# EAGLE design projeson1 (EAGLE 6.3)
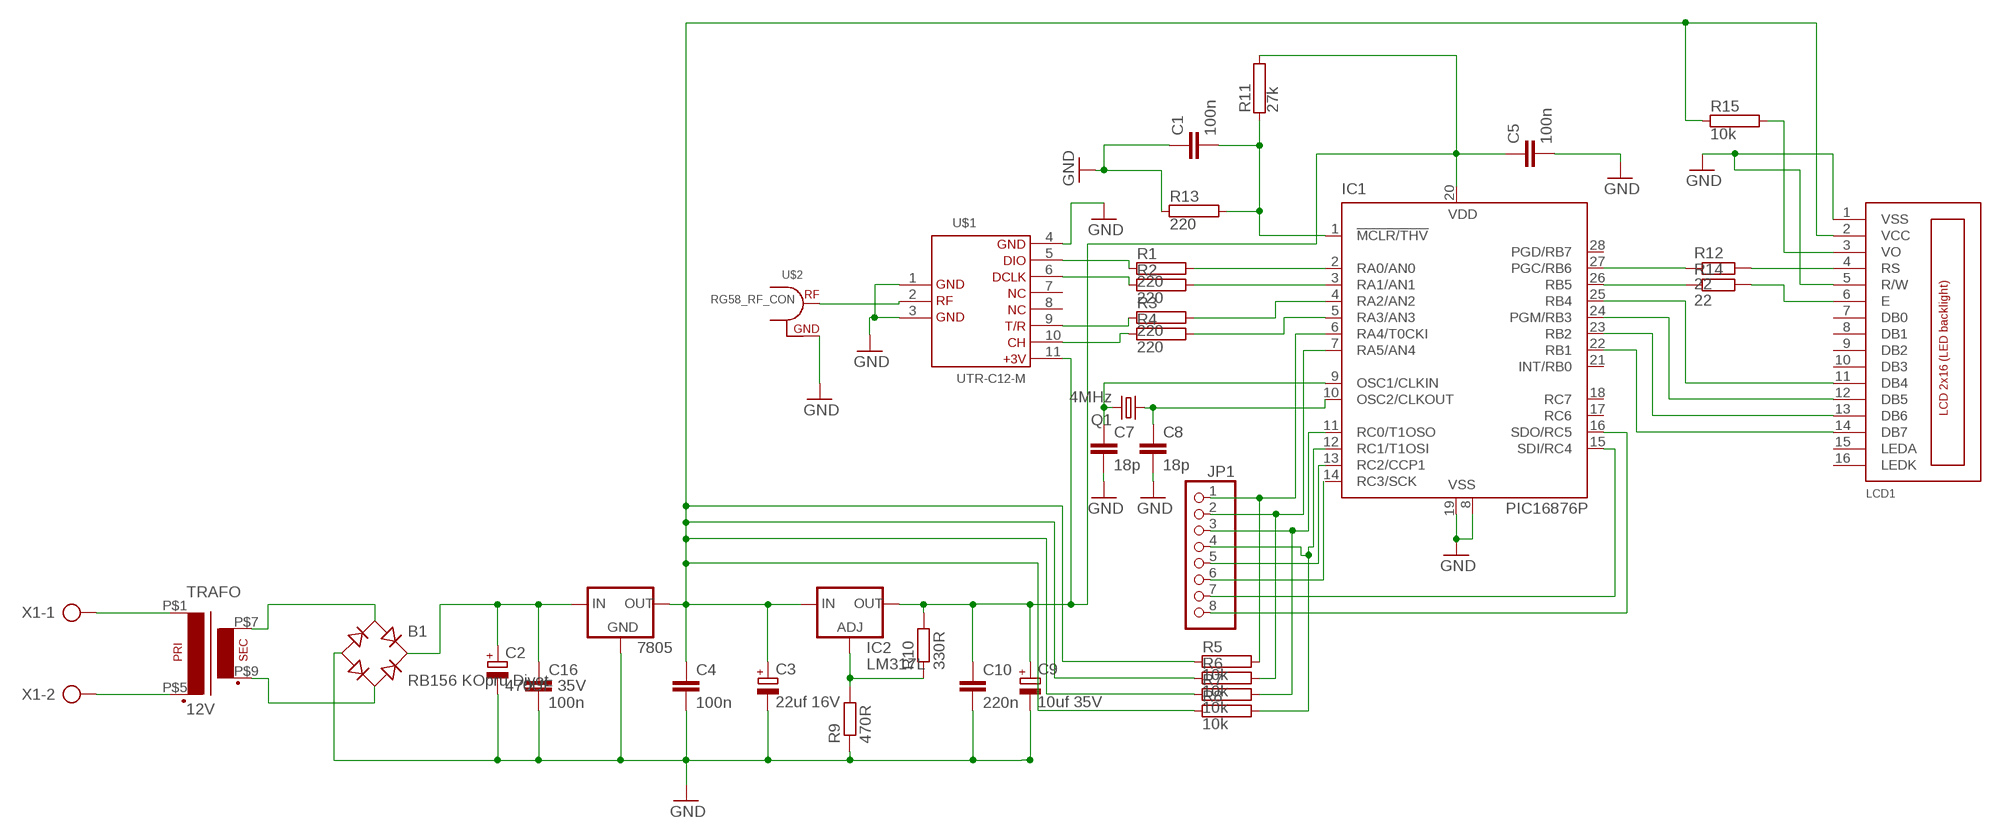
[diagram p0: schematic, sheet 1]

## Parts
7805  78XXS  [78XXS]
B1  RB156 KOpru Diyot  RB1A  [RB1A]
C1  100n  C-EU025-030X050  [C025-030X050]
C2  470UF 35V  CPOL-EUE3.5-10  [E3,5-10]
C3  22uf 16V  CPOL-EUE2.5-7  [E2,5-7]
C4  100n  C-EU050-025X075  [C050-025X075]
C5  100n  C-EU025-025X050  [C025-025X050]
C7  18p  C-EU025-025X050  [C025-025X050]
C8  18p  C-EU025-025X050  [C025-025X050]
C9  10uf 35V  CPOL-EUE2.5-7  [E2,5-7]
C10  220n  C-EU050-025X075  [C050-025X075]
C16  100n  C-EU050-025X075  [C050-025X075]
IC1  PIC16876P  [DIL28-3]
IC2  LM317L  [317L]
JP1  PINHD-1X8  [1X08]
LCD1  LCD_2X16_SIL  [HY-1602F]
Q1  4MHz  CRYTALHC49S  [HC49/S]
R1  220  RAC04  [AC04]
R2  220  RAC04  [AC04]
R3  220  RAC04  [AC04]
R4  220  RAC04  [AC04]
R5  10k  RAC04  [AC04]
R6  10k  RAC04  [AC04]
R7  10k  RAC04  [AC04]
R8  10k  RAC04  [AC04]
R9  470R  R-EU_0207/10  [0207/10]
R10  330R  R-EU_0207/10  [0207/10]
R11  27k  RAC04  [AC04]
R12  22  R-EU_0204/5  [0204/5]
R13  220  RAC04  [AC04]
R14  22  R-EU_0204/5  [0204/5]
R15  10k  RAC04  [AC04]
TRAFO  12V  TRAFO  [E3031TRF]
U$1  UTR-C12-M  [UTR-C12-M]
U$2  RG58_RF_CON  [RG58_RF_CON]
X1  AK300/3  [AK300/3]

## Nets
GND: 7805.GND B1.- C1.1 C2.- C3.- C4.2 C5.2 C7.2 C8.2 C9.- C10.2 C16.2 IC1.8(VSS) IC1.19(VSS) LCD1.1(VSS) LCD1.5(R/W) R9.1 R13.1 U$1.1 U$1.3 U$1.4 U$2.GND
N$1: R1.1 U$1.5
N$2: R3.1 U$1.9
N$3: IC1.4(RA2/AN2) R3.2
N$4: R4.1 U$1.10
N$5: IC1.2(RA0/AN0) R1.2
N$6: IC1.3(RA1/AN1) R2.2
N$7: LCD1.6(E) R14.2
N$8: IC1.5(RA3/AN3) R4.2
N$9: LCD1.3(VO) R15.2
N$10: IC1.6(RA4/T0CKI) JP1.1 R5.2
N$11: IC1.7(RA5/AN4) JP1.2 R6.2
N$12: IC1.11(RC0/T1OSO) JP1.3 R7.2
N$13: IC1.12(RC1/T1OSI) JP1.4 R8.2
N$14: IC1.13(RC2/CCP1) JP1.5
N$15: JP1.6
N$16: IC1.15(SDI/RC4) JP1.7
N$17: IC1.16(SDO/RC5) JP1.8
N$18: LCD1.4(RS) R12.2
N$19: IC1.26(RB5) R14.1
N$20: IC1.25(RB4) LCD1.11(DB4)
N$21: IC1.24(PGM/RB3) LCD1.12(DB5)
N$22: IC1.23(RB2) LCD1.13(DB6)
N$23: IC1.22(RB1) LCD1.14(DB7)
N$24: TRAFO.P$5 X1.2
N$25: B1.AC1 TRAFO.P$7
N$26: B1.AC2 TRAFO.P$9
N$27: 7805.IN B1.+ C2.+ C16.1
N$28: TRAFO.P$1 X1.1
N$29: IC2.1(ADJ) R9.2 R10.1
N$30: IC1.27(PGC/RB6) R12.1
N$31: U$1.2 U$2.RF
N$32: C1.2 IC1.1(!MCLR/THV) R11.1 R13.2
N$34: C7.1 IC1.9(OSC1/CLKIN) Q1.2
N$35: C8.1 IC1.10(OSC2/CLKOUT) Q1.1
N$37: R2.1 U$1.6
N$38: 7805.OUT C3.+ C4.1 IC2.3(IN) LCD1.2(VCC) R5.1 R6.1 R7.1 R8.1 R15.1
N$41: C5.1 C9.+ C10.1 IC1.20(VDD) IC2.2(OUT) R10.2 R11.2 U$1.11
Unconnected: IC1.14(RC3/SCK) IC1.17(RC6) IC1.18(RC7) IC1.21(INT/RB0) IC1.28(PGD/RB7) LCD1.7(DB0) LCD1.8(DB1) LCD1.9(DB2) LCD1.10(DB3) LCD1.15(LEDA) LCD1.16(LEDK) U$1.7 U$1.8 X1.3

## Library data of the parts
7805 = v-reg:78XXS: VOLTAGE REGULATOR
B1 = rectifier:RB1A: RECTIFIER 1 A
C1 C4 C5 C7 C8 C10 C16 = rcl:C-EU: CAPACITOR, European symbol
C2 C3 C9 = rcl:CPOL-EU: POLARIZED CAPACITOR, European symbol
IC1 = microchip:PIC16*876: MICROCONTROLLER flash type; OC_FARNELL: unknown; OC_NEWARK: unknown
IC2 = v-reg:LM317L: VOLTAGE REGULATOR
JP1 = pinhead:PINHD-1X8: PIN HEADER
LCD1 = lcd_2x16_led_backlight:LCD_2X16_SIL
Q1 = crystal:CRYTAL: CRYSTAL
R1-R8 R11 R13 R15 = resistor-power:R: Power Resitor; OC_FARNELL: unknown; OC_NEWARK: unknown
R9 R10 R12 R14 = rcl:R-EU_: RESISTOR, European symbol
TRAFO = UDEA3:TRAFO
U$1 = UDEA_HAKKI:UTR-C12-M
U$2 = UDEA_HAKKI:RG58_RF_CON
X1 = con-ptr500:AK300/3: CONNECTOR; OC_FARNELL: unknown; OC_NEWARK: unknown

## Board
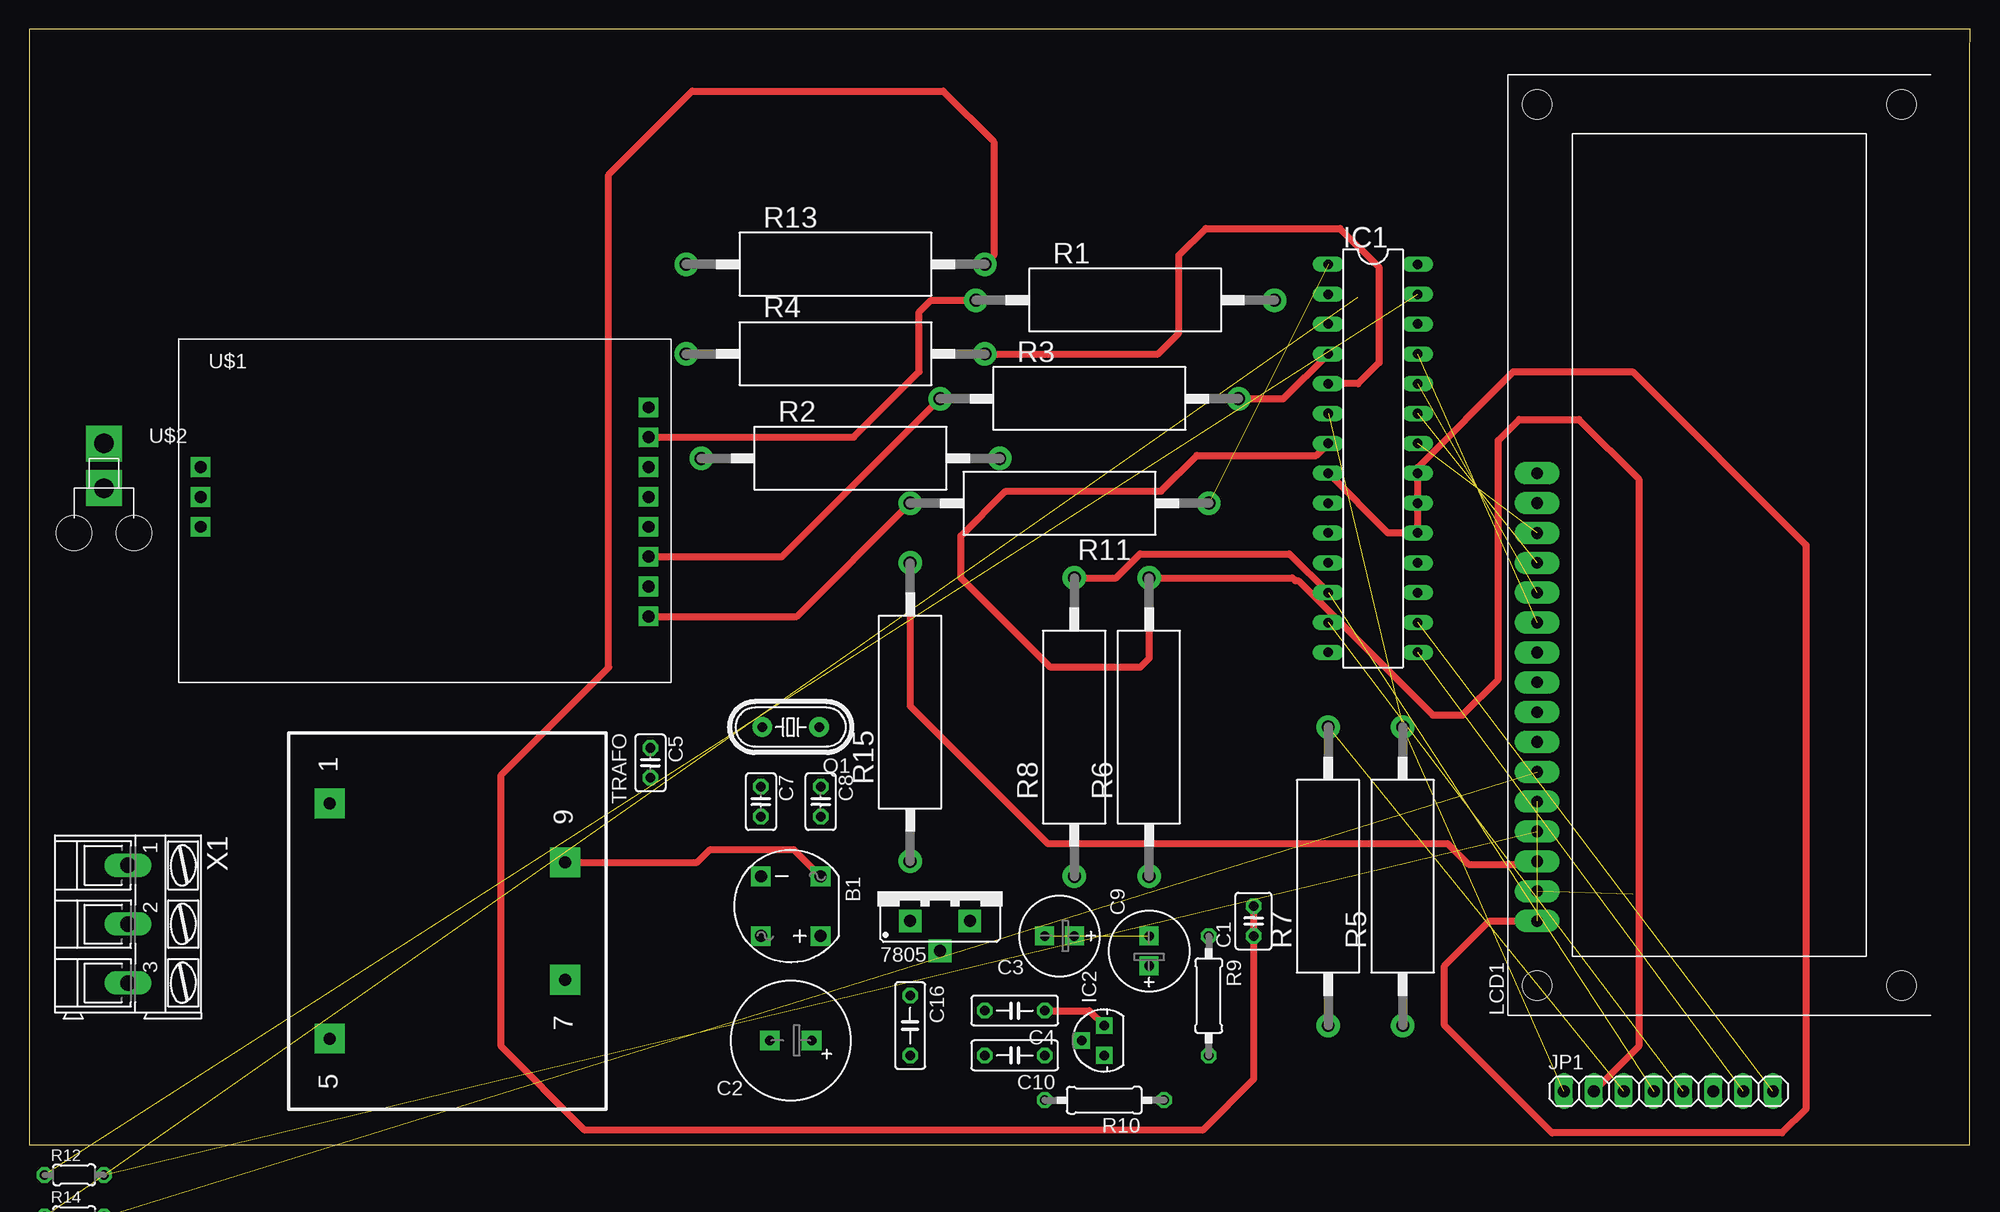
[diagram p1: board, top side]
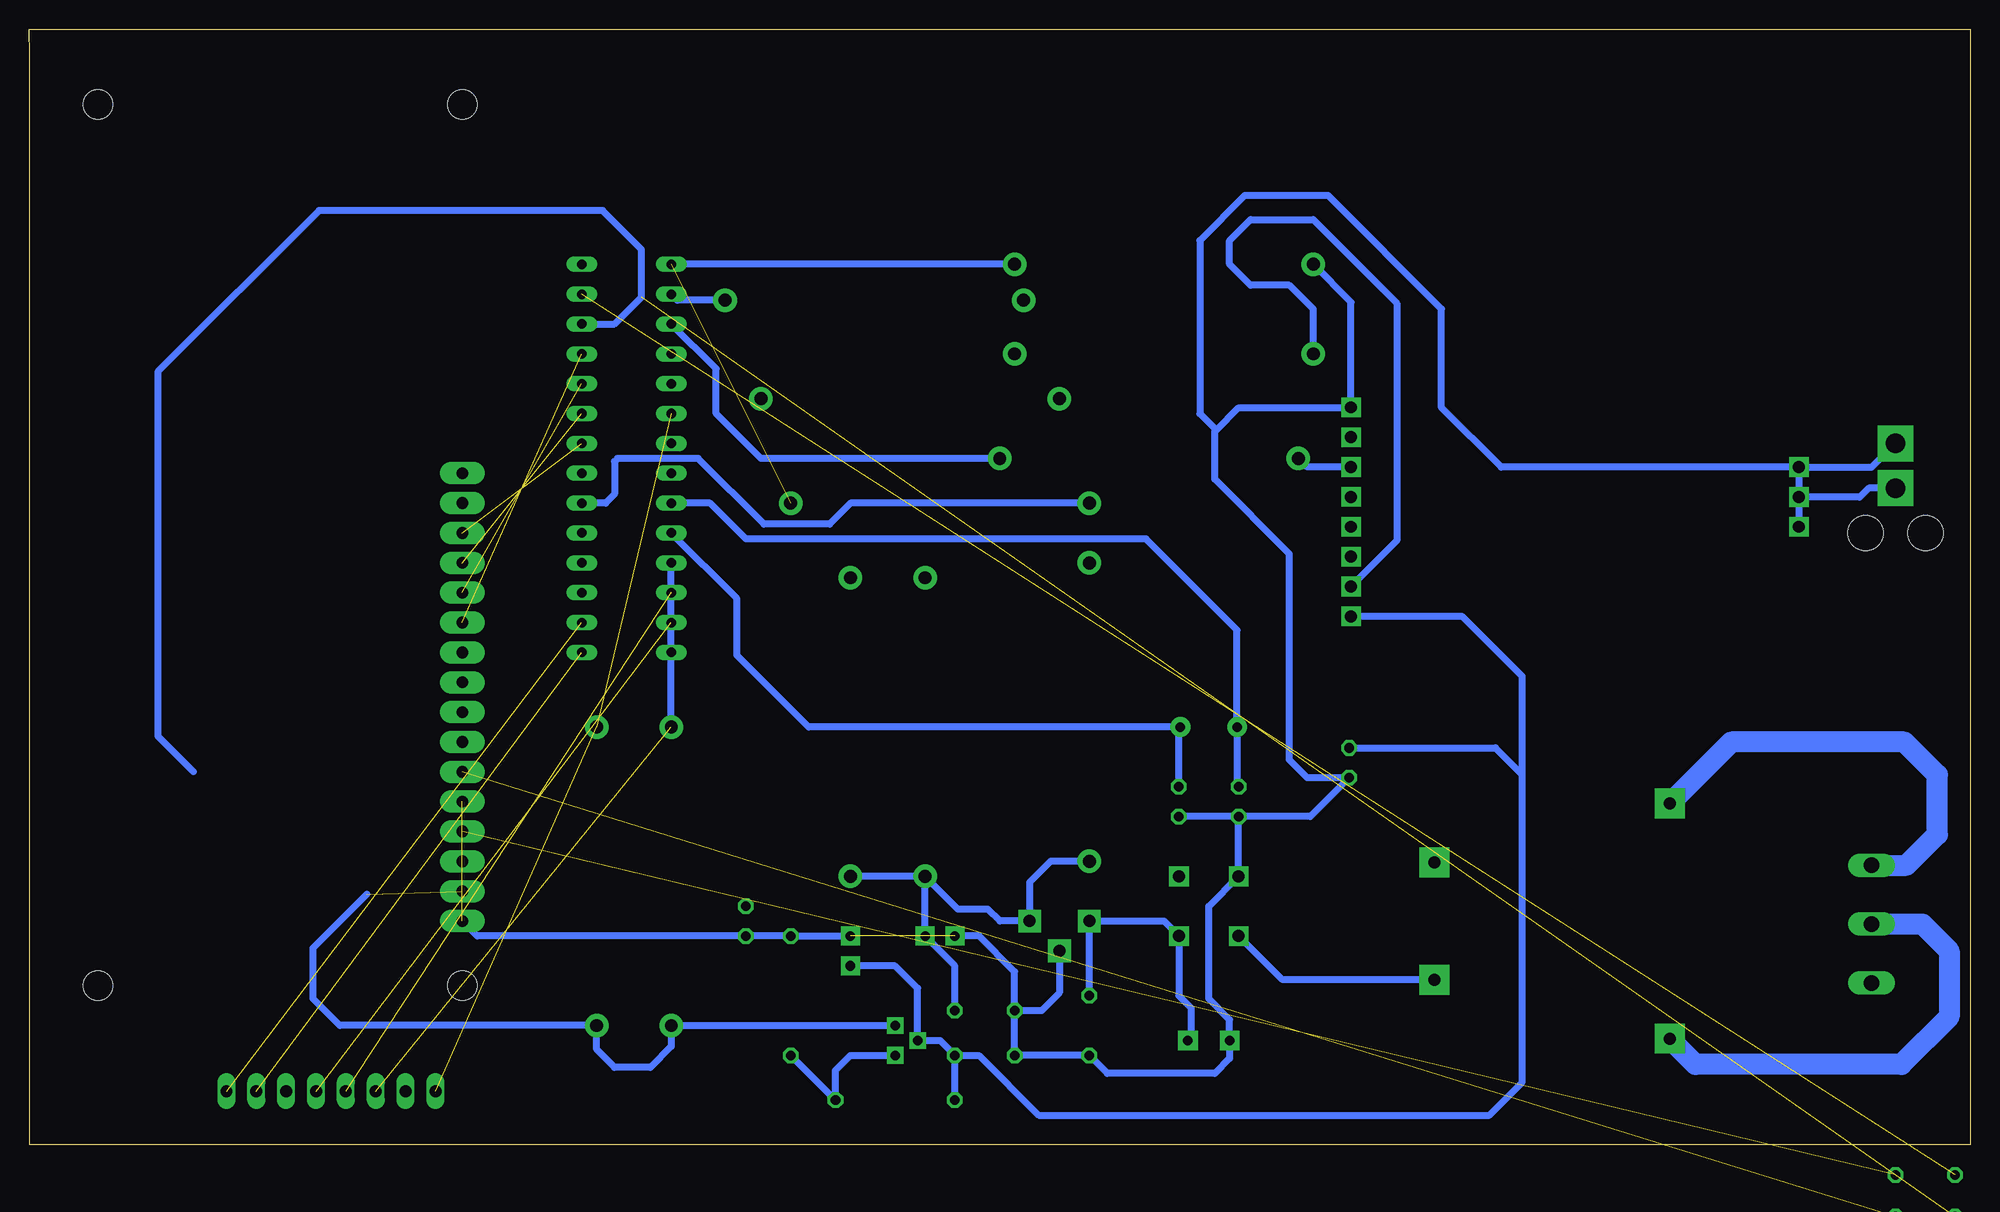
[diagram p2: board, bottom side, seen from below]

Size 165.1 x 94.92 mm. Coordinates in mm from the lower left corner, seen from the top.
Outline: 0,0 165.08,0 165.08,93.65 165.1,93.98 165.1,94.92 0,94.92 0,0
Copper layers (1*16): Top 0.035mm / dielectric 1.5mm / Bottom 0.035mm
Design rules "default": minimum track width 10mil, minimum drill 24mil, track to track 8mil, track to pad 8mil, pad to pad 8mil, via to via 8mil, smd to smd 8mil, copper to edge 40mil, drill to drill 8mil, minimum pad ring 10mil, minimum via ring 8mil, stop-mask expansion 4mil, vias tented up to drill 0mil, thermal gap 10mil

### Footprints (pad centres in the part's own frame; a part is rotated, then mirrored left to right if it is on the bottom)
78XXS = drill 1.016 pad 1.93 square: GND 0,-5.08; IN -2.54,-2.54; OUT 2.54,-2.54
RB1A = drill 1.016 pad 1.676 square: + -2.54,2.54; - 2.54,-2.54; AC1 2.54,2.54; AC2 -2.54,-2.54
C025-030X050 = drill 0.813 octagon: 1 -1.27,0; 2 1.27,0
E3,5-10 = drill 0.813 pad 1.676 square: + -1.778,0; - 1.778,0
E2,5-7 = drill 0.813 pad 1.6 square: + -1.27,0; - 1.27,0
C050-025X075 = drill 0.813 octagon: 1 -2.54,0; 2 2.54,0
C025-025X050 = drill 0.813 octagon: 1 -1.27,0; 2 1.27,0
DIL28-3 = drill 0.813 long: 1 -16.51,-3.81; 2 -13.97,-3.81; 3 -11.43,-3.81; 4 -8.89,-3.81; 5 -6.35,-3.81; 6 -3.81,-3.81; 7 -1.27,-3.81; 8 1.27,-3.81; 9 3.81,-3.81; 10 6.35,-3.81; 11 8.89,-3.81; 12 11.43,-3.81; 13 13.97,-3.81; 14 16.51,-3.81; 15 16.51,3.81; 16 13.97,3.81; 17 11.43,3.81; 18 8.89,3.81; 19 6.35,3.81; 20 3.81,3.81; 21 1.27,3.81; 22 -1.27,3.81; 23 -3.81,3.81; 24 -6.35,3.81; 25 -8.89,3.81; 26 -11.43,3.81; 27 -13.97,3.81; 28 -16.51,3.81
317L = drill 0.813 pad 1.422 square: 1 -1.27,0; 2 0,1.905; 3 1.27,0
1X08 = drill 1.016 long: 1 -8.89,0; 2 -6.35,0; 3 -3.81,0; 4 -1.27,0; 5 1.27,0; 6 3.81,0; 7 6.35,0; 8 8.89,0
HY-1602F = drill 1 pad 1.93 long: 1 2.54,0; 2 5.08,0; 3 7.62,0; 4 10.16,0; 5 12.7,0; 6 15.24,0; 7 17.78,0; 8 20.32,0; 9 22.86,0; 10 25.4,0; 11 27.94,0; 12 30.48,0; 13 33.02,0; 14 35.56,0; 15 38.1,0; 16 40.64,0 | hole 2.5: -2.96,0; 72.04,0; -2.96,-31; 72.04,-31
HC49/S = drill 0.813 pad 1.676: 1 -2.413,0; 2 2.413,0
AC04 = drill 1.1 pad 2: 1 -12.7,0; 2 12.7,0
0207/10 = drill 0.813 octagon: 1 -5.08,0; 2 5.08,0
0204/5 = drill 0.813 octagon: 1 -2.54,0; 2 2.54,0
E3031TRF = drill 1.016 pad 2.54 square: P$1 -10,-10; P$5 10,-10; P$7 5,10; P$9 -5,10
UTR-C12-M = drill 1.016 pad 1.676 square: 1 -17.188,4.333; 2 -17.188,1.796; 3 -17.188,-0.739; 4 20.912,9.421; 5 20.912,6.878; 6 20.912,4.341; 7 20.912,1.801; 8 20.912,-0.742; 9 20.912,-3.282; 10 20.912,-5.817; 11 20.916,-8.358
RG58_RF_CON = drill 1.676 pad 3.048 square: GND 0,7.62; RF 0,3.81 | hole 2.997: -2.54,0; 2.54,0
AK300/3 = drill 1.321 long: 1 -5.004,0; 2 0,0; 3 5.004,0

### Placement (x,y rotation side)
7805  77.47,21.59 0 top
B1  64.77,20.32 180 top
C1  104.14,19.05 90 top
C2  64.77,8.89 180 top
C3  87.63,17.78 180 top
C4  83.82,11.43 180 top
C5  52.83,32.51 270 top
C7  62.23,29.21 270 top
C8  67.31,29.21 270 top
C9  95.25,16.51 90 top
C10  83.82,7.62 180 top
C16  74.93,10.16 270 top
IC1  114.3,58.42 270 top
IC2  91.44,8.89 90 top
JP1  139.45,4.57 0 top
LCD1  128.27,16.51 90 top
Q1  64.77,35.56 180 top
R1  93.22,71.88 0 top
R2  69.85,58.42 0 top
R3  90.17,63.5 0 top
R4  68.58,67.31 0 top
R5  116.84,22.86 90 top
R6  95.25,35.56 90 top
R7  110.49,22.86 90 top
R8  88.9,35.56 90 top
R9  100.33,12.7 270 top
R10  91.44,3.81 180 top
R11  87.63,54.61 180 top
R12  3.81,-2.54 0 top
R13  68.58,74.93 0 top
R14  3.81,-6.1 0 top  (outside the outline)
R15  74.93,36.83 90 top
TRAFO  35.56,19.05 270 top
U$1  31.75,53.34 0 top
U$2  6.35,52.07 0 top
X1  8.38,18.8 270 top

### Tracks (layer width: path | path; a pad name or v marks a point on that pad's centre or on a via)
GND  (2 unrouted)
  Top 0.61: IC1.8 115.57,52.07 IC1.19 118.11,57.66 126.24,65.79 136.4,65.79 151.13,51.05 151.13,3.05 149.1,1.02 129.54,1.02 120.4,10.16 120.4,15.24 124.21,19.05 LCD1.1
  Bottom 0.61: C4.2 C10.2 C16.2 73.41,6.1 64.26,6.1 62.99,7.37 C2.- 62.99,10.67 64.77,12.45 64.77,20.32 B1.- C7.2 | C4.2 81.28,14.73 84.33,17.78 C3.- | 7805.GND 77.47,12.95 78.99,11.43 C4.2 | LCD1.1 127,17.78 C1.1 R9.1 C9.- | C7.2 C8.2 | C7.2 56.13,27.94 C5.2 56.39,31.24 57.91,32.77 57.91,50.29 64.26,56.64 64.26,60.71 64.14,60.83 | 64.14,60.83 62.23,62.74 52.69,62.74 U$1.4 52.66,71.71 R13.1 | U$1.1 39.89,57.67 44.96,62.74 44.96,71.12 54.61,80.77 61.72,80.77 65.53,76.96 65.53,62.23 64.14,60.83 | U$1.1 8.37,57.67 U$2.GND | U$1.1 U$1.3
N$1
  Top 0.61: U$1.5 70.12,60.22 75.69,65.79 75.69,70.87 76.71,71.88 R1.1
N$2
  Top 0.61: U$1.9 64.03,50.06 R3.1
N$3
  Top 0.61: R3.2 106.68,63.5 IC1.4
N$4
  Bottom 0.61: R4.1 55.88,71.12 57.91,73.15 61.21,73.15 62.99,74.93 62.99,76.96 61.21,78.74 55.88,78.74 48.77,71.63 48.77,51.42 U$1.10
N$5
  Bottom 0.61: R1.2 109.98,71.88 IC1.2
N$6
  Bottom 0.61: R2.2 102.87,58.42 106.68,62.23 106.68,66.04 IC1.3
N$7  (1 unrouted)
N$8
  Top 0.61: R4.2 96.01,67.31 97.79,69.09 97.79,75.69 100.08,77.98 111.51,77.98 114.81,74.68 114.81,66.55 113.03,64.77 IC1.5
N$9
  Top 0.61: R15.2 74.93,37.34 86.61,25.65 120.65,25.65 122.43,23.88 128.02,23.88 LCD1.3
N$10  (2 unrouted)
N$11
  Top 0.61: IC1.7 109.47,58.67 99.31,58.67 96.27,55.63 83.06,55.63 79.25,51.82 79.25,48.26 86.87,40.64 94.49,40.64 95.25,41.4 R6.2 107.44,48.26 107.7,48.01 107.95,48.01 119.38,36.58 121.92,36.58 124.97,39.62 124.97,59.94 126.75,61.72 131.83,61.72 136.91,56.64 136.91,8.38 JP1.2
N$12  (1 unrouted)
  Bottom 0.61: R7.2 IC1.11
N$13  (1 unrouted)
  Top 0.61: R8.2 92.46,48.26 94.49,50.29 107.19,50.29 IC1.12
N$14  (1 unrouted)
N$16  (1 unrouted)
N$17  (1 unrouted)
N$18  (1 unrouted)
N$19  (1 unrouted)
  Bottom 0.61: IC1.26 115.32,69.85 113.03,72.14 113.03,76.2 116.33,79.5 140.46,79.5 154.18,65.79 154.18,34.8 151.13,31.75
N$20  (1 unrouted)
N$21  (1 unrouted)
N$22  (1 unrouted)
N$23  (1 unrouted)
N$24
  Bottom 1.778: X1.2 4.06,18.8 1.78,16.51 1.78,10.92 5.84,6.86 23.37,6.86 TRAFO.P$5
N$25
  Bottom 0.61: TRAFO.P$7 58.5,14.05 B1.AC1
N$26
  Top 0.61: TRAFO.P$9 56.82,24.05 57.91,25.15 65.02,25.15 B1.AC2
N$27
  Bottom 0.61: C16.1 7805.IN 68.58,19.05 B1.+ 67.31,12.7 66.29,11.68 66.29,9.14 C2.+
N$28
  Bottom 1.778: X1.1 5.41,23.8 2.79,26.42 2.79,31.5 5.59,34.29 20.32,34.29 TRAFO.P$1
N$29
  Bottom 0.61: R9.2 R10.1 96.52,6.35 95.25,7.62 IC2.1
N$30  (1 unrouted)
N$31
  Bottom 0.61: U$2.RF 8.64,55.88 9.4,55.12 14.54,55.12 U$1.2
N$32  (1 unrouted)
  Top 0.61: C1.2 104.14,5.59 99.82,1.27 47.24,1.27 40.13,8.38 40.13,31.5 49.28,40.64 49.28,82.55 56.39,89.66 77.72,89.66 82.04,85.34 82.04,75.69 R13.2
  Bottom 0.61: R13.2 IC1.1
N$34
  Bottom 0.61: C7.1 62.36,30.61 Q1.2 62.36,43.81 70.1,51.56 104.14,51.56 107.19,54.61 IC1.9
N$35
  Bottom 0.61: C8.1 67.31,35.43 Q1.1 98.81,35.56 104.9,41.66 104.9,46.48 IC1.10
N$37
  Bottom 0.61: U$1.6 56.41,57.68 R2.1
N$38  (1 unrouted)
  Top 0.61: C4.1 90.17,11.43 IC2.3
  Bottom 0.61: IC2.3 R7.1 110.49,8.38 112.27,6.6 115.32,6.6 116.84,8.13 R5.1 138.68,10.16 140.97,12.45 140.97,16.76 136.4,21.34 | C4.1 86.36,15.24 C3.+ R8.1 | R15.1 78.23,24.13 80.01,22.35 7805.OUT 82.55,19.05 83.57,20.07 86.11,20.07 R8.1 | R8.1 R6.1
N$41
  Top 0.61: U$1.11 65.3,44.98 R11.2
  Bottom 0.61: R10.2 C10.1 | C10.1 87.63,8.89 IC2.2 89.54,13.34 91.44,15.24 C9.+ | C10.1 84.33,7.62 79.25,2.54 40.89,2.54 38.1,5.33 38.1,31.5 | 38.1,31.5 38.1,39.88 43.18,44.96 52.64,44.96 U$1.11 | C5.1 40.39,33.78 38.1,31.5 | R11.2 95.25,54.61 97.03,52.83 102.62,52.83 108.2,58.42 115.06,58.42 115.32,58.17 115.32,55.37 116.08,54.61 IC1.20